# Altium schematic sheet vcc-test.SchDoc
size A
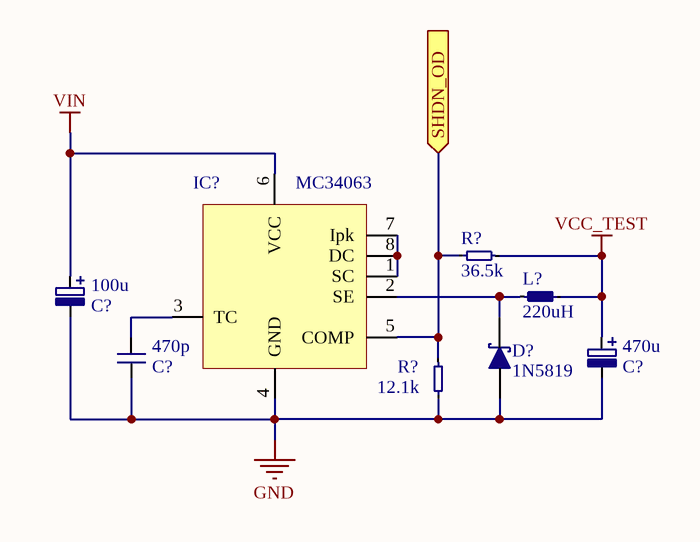
[diagram p0: vcc-test.SchDoc]

## Parts
(Parts that share a designator on the sheet are numbered #1, #2 ... from top to bottom, then left to right.)
C?#1  100u
C?#2  470p
C?#3  470u
D?  1N5819
IC?  MC34063  [SO-8]
L?  220uH
R?#1  36.5k
R?#2  12.1k

## Ports
SHDN_OD (in)

## Nets
GND: C?#1.2 C?#2.2 C?#3.2 D?.A IC?.4(GND) R?#2.2
VCC_TEST: C?#3.1 L?.2 R?#1.1
VIN: C?#1.1 IC?.6(VCC)
SHDN_OD: IC?.5(COMP) R?#1.2 R?#2.1 ; port SHDN_OD
NetC?#2_1: C?#2.1 IC?.3(TC)
NetD?_K: D?.K IC?.2(SE) L?.1
NetIC?_1: IC?.1(SC) IC?.7(Ipk) IC?.8(DC)

## Library data of the parts
C?#1 C?#3 = Cap_El
C?#2 = Cap
D? = Schottky: Schottky Diode
L? = Inductor
R?#1 R?#2 = Res